# Altium schematic sheet SNES_DRONE_LEVEL_SHIFTER_2.SchDoc
size A4
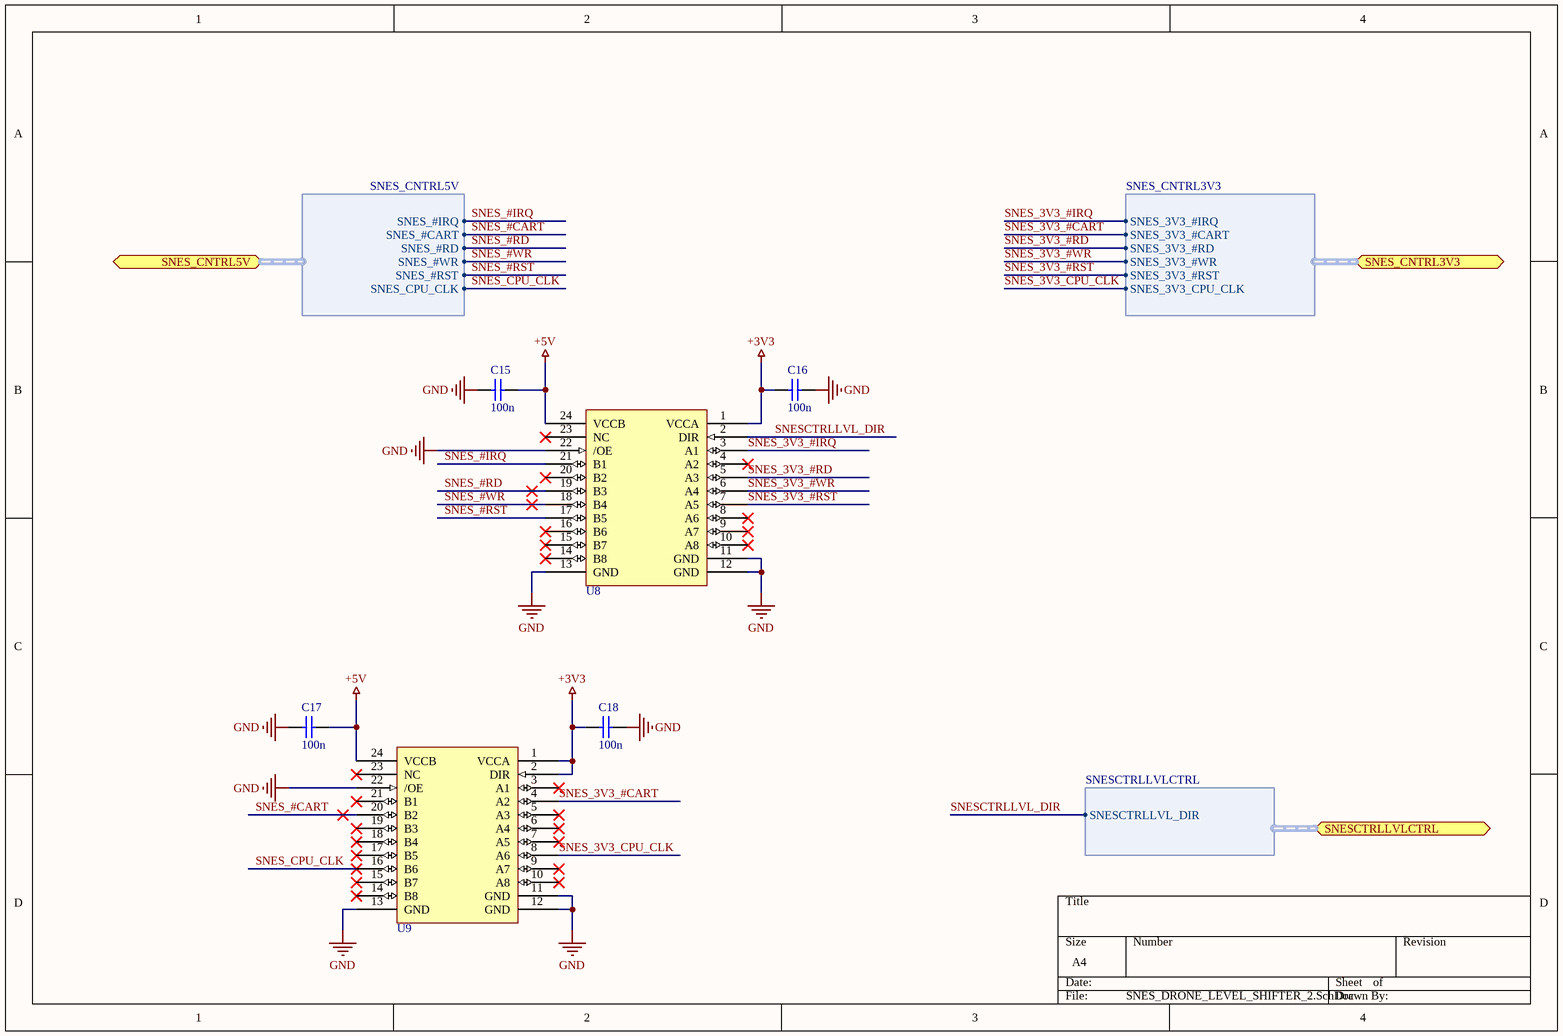
[diagram p0: SNES_DRONE_LEVEL_SHIFTER_2.SchDoc]

## Parts
C15  value 100n  [cap_0603]  (hidden comment: cap_0603)
C16  value 100n  [cap_0603]  (hidden comment: cap_0603)
C17  value 100n  [cap_0603]  (hidden comment: cap_0603)
C18  value 100n  [cap_0603]  (hidden comment: cap_0603)
U8  IC_SN74LVCC3245APWR  [TSSOP24]  (value not drawn)
U9  IC_SN74LVCC3245APWR  [TSSOP24]  (value not drawn)

## Ports
SNES_CNTRL3V3 (bidir, harness SNES_CNTRL3V3), SNES_CNTRL5V (bidir, harness SNES_CNTRL5V), SNESCTRLLVLCTRL (bidir, harness SNESCTRLLVLCTRL)

## Harnesses
SNES_CNTRL5V: SNES_#IRQ, SNES_#CART, SNES_#RD, SNES_#WR, SNES_#RST, SNES_CPU_CLK
SNES_CNTRL3V3: SNES_3V3_#IRQ, SNES_3V3_#CART, SNES_3V3_#RD, SNES_3V3_#WR, SNES_3V3_#RST, SNES_3V3_CPU_CLK
SNESCTRLLVLCTRL: SNESCTRLLVL_DIR

## Nets
+3V3: C16.2 C18.2 U8.1(VCCA) U9.1(VCCA) U9.2(DIR)
+5V: C15.1 C17.1 U8.24(VCCB) U9.24(VCCB)
GND: C15.2 C16.1 C17.2 C18.1 U8.11(GND) U8.12(GND) U8.13(GND) U8.22(/OE) U9.11(GND) U9.12(GND) U9.13(GND) U9.22(/OE)
SNES_3V3_#CART: U9.4(A2) ; port SNES_CNTRL3V3.SNES_3V3_#CART
SNES_3V3_#IRQ: U8.3(A1) ; port SNES_CNTRL3V3.SNES_3V3_#IRQ
SNES_3V3_#RD: U8.5(A3) ; port SNES_CNTRL3V3.SNES_3V3_#RD
SNES_3V3_#RST: U8.7(A5) ; port SNES_CNTRL3V3.SNES_3V3_#RST
SNES_3V3_#WR: U8.6(A4) ; port SNES_CNTRL3V3.SNES_3V3_#WR
SNES_3V3_CPU_CLK: U9.8(A6) ; port SNES_CNTRL3V3.SNES_3V3_CPU_CLK
SNES_#CART: U9.20(B2) ; port SNES_CNTRL5V.SNES_#CART
SNES_#IRQ: U8.21(B1) ; port SNES_CNTRL5V.SNES_#IRQ
SNES_#RD: U8.19(B3) ; port SNES_CNTRL5V.SNES_#RD
SNES_#RST: U8.17(B5) ; port SNES_CNTRL5V.SNES_#RST
SNES_#WR: U8.18(B4) ; port SNES_CNTRL5V.SNES_#WR
SNES_CPU_CLK: U9.16(B6) ; port SNES_CNTRL5V.SNES_CPU_CLK
SNESCTRLLVL_DIR: U8.2(DIR) ; port SNESCTRLLVLCTRL.SNESCTRLLVL_DIR

Not connected (* = marked no-connect by the designer): U8 4(A2)* 8(A6)* 9(A7)* 10(A8)* 14(B8)* 15(B7)* 16(B6)* 20(B2)* 23(NC)*; U9 3(A1)* 5(A3)* 6(A4)* 7(A5)* 9(A7)* 10(A8)* 14(B8)* 15(B7)* 17(B5)* 18(B4)* 19(B3)* 21(B1)* 23(NC)*

## Library data of the parts
C15-C18 = cap_0603: Capacitor
U8 U9 = IC_SN74LVCC3245APWR: Bus-Transceiver, Produktreihe LVC, 8 Eingänge, 50mA, 7ns, 2.3V bis 5.5V, TSSOP 24; Manufacturer 1: TEXAS INSTRUMENTS; ComponentLink3Description: datsheet; ComponentLink3URL: http://www.ti.com/lit/ds/symlink/sn74lvcc3245a.pdf; ComponentLink4Description: farnell; ComponentLink4URL: https://at.farnell.com/texas-instruments/sn74lvcc3245apwr/bus-transceiver-8bit-tssop-24/dp/2854646?rpsku=rel3%3A2119962&st=2119962; Supplier 1: Farnell; Supplier Part Number 1: 2854646; Manufacturer Part Number 1: SN74LVCC3245APWR; Supplier Unit Price 1: 0,99; Supplier Order Qty 1: 1